# Altium project Nixie.PrjPcb
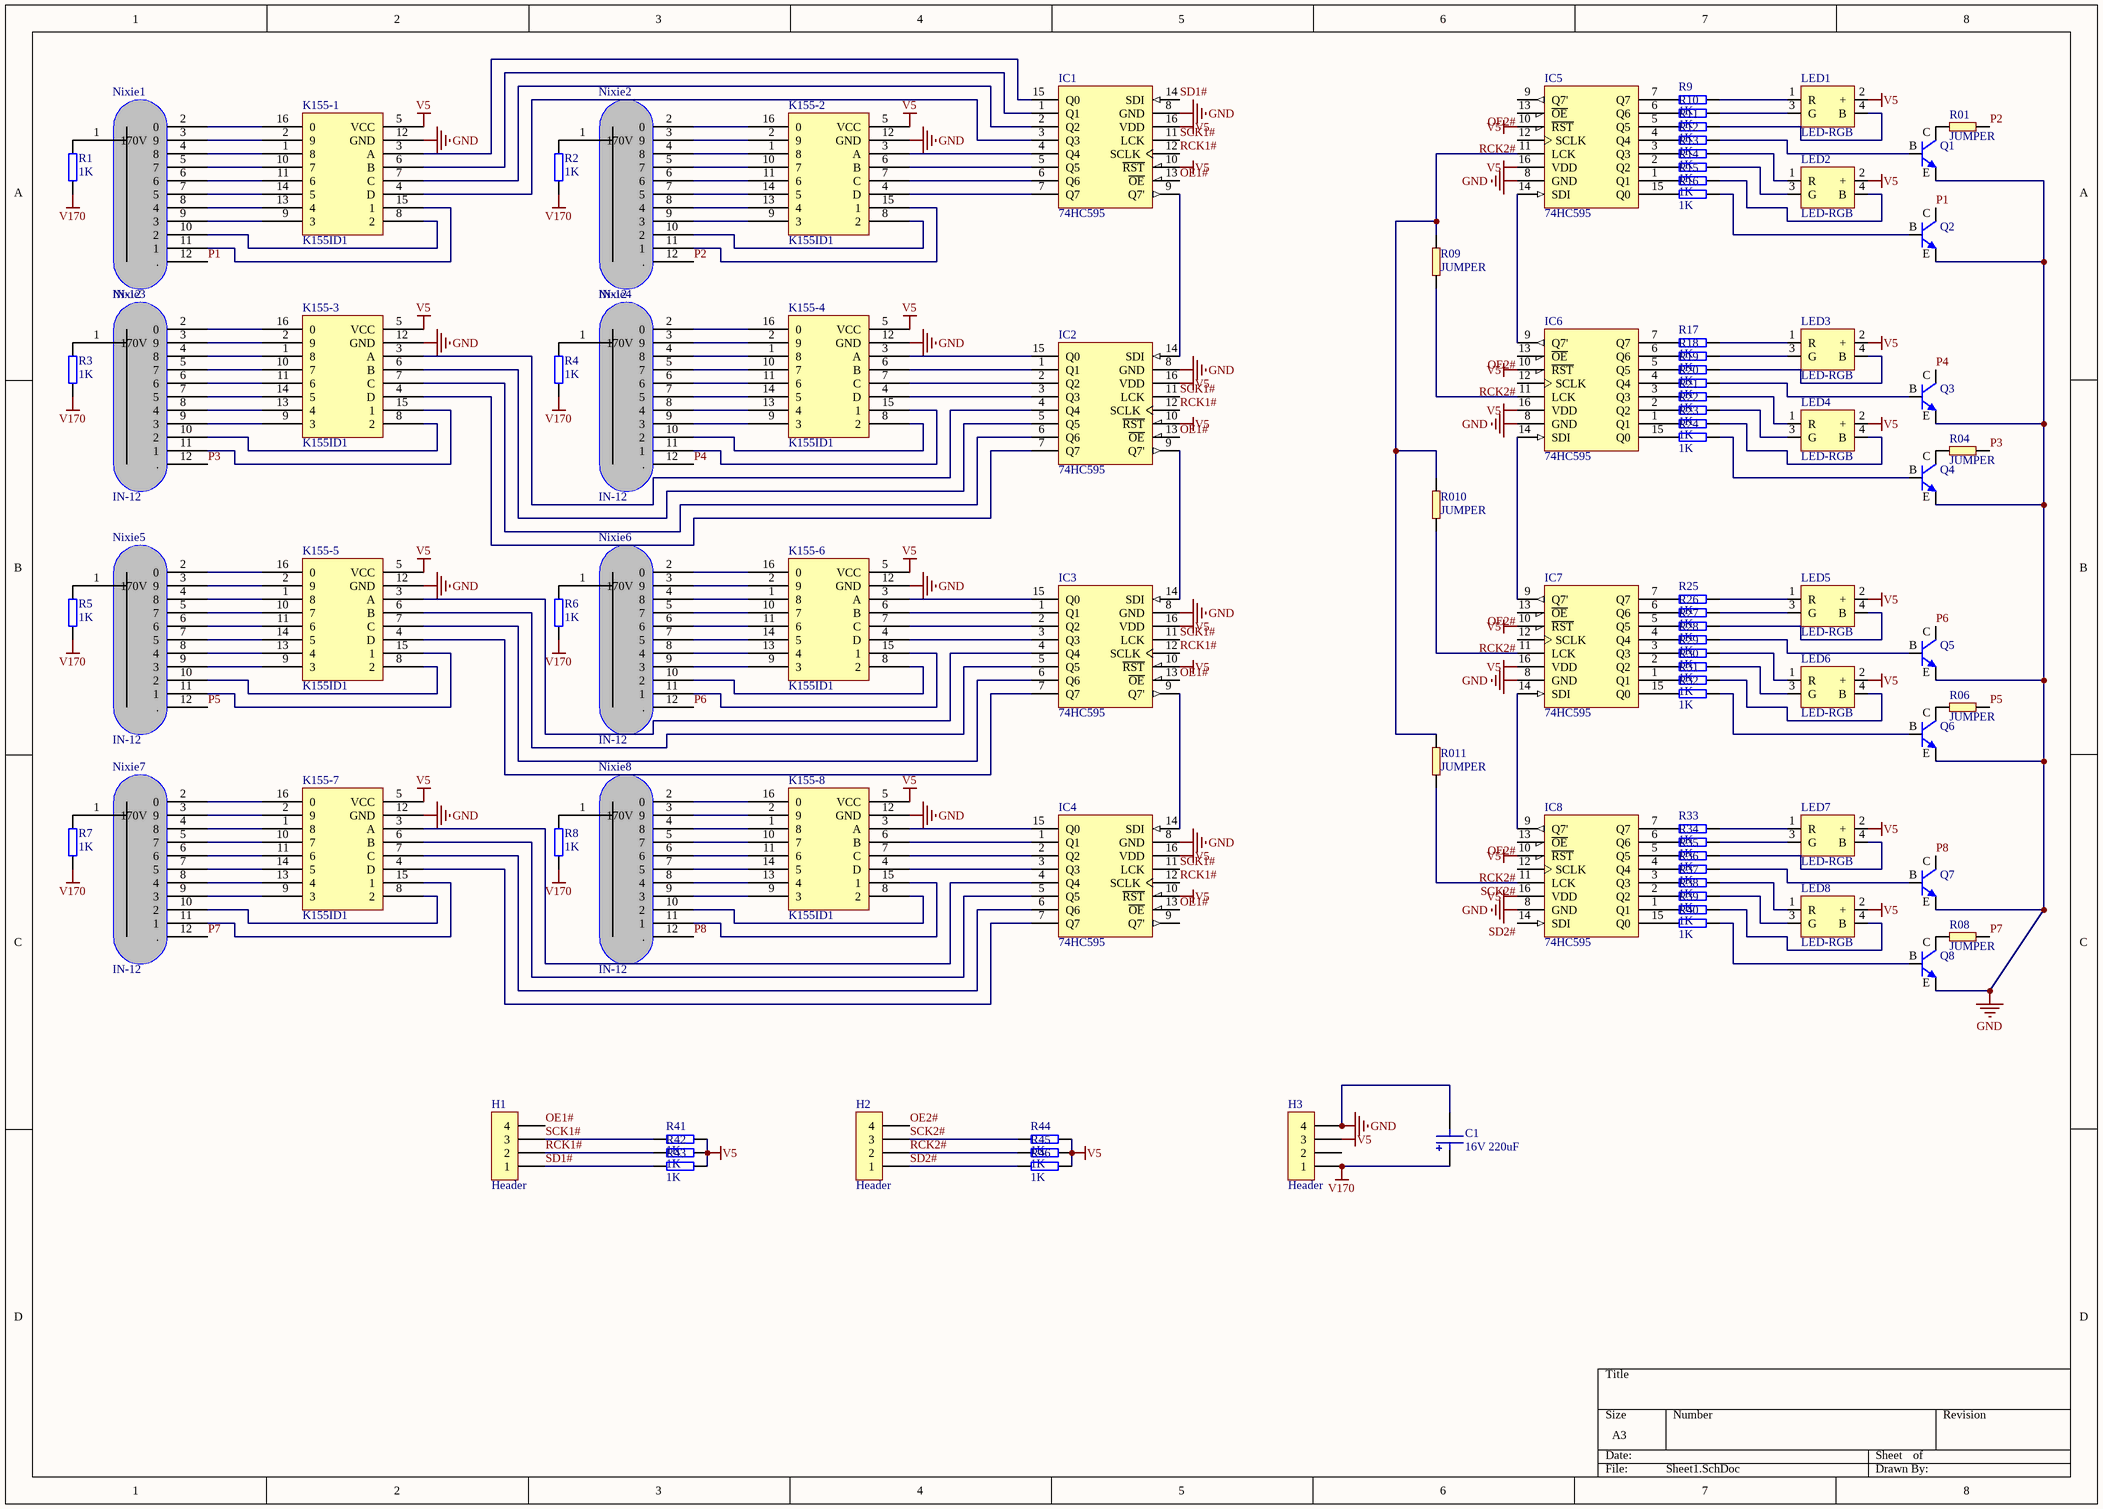
[diagram p0: Sheet1.SchDoc]
1 sheet, 97 parts. Net scope: global (net labels, ports and power ports of the same name join across sheets).
Board file: PCB1.PcbDoc

## Sheet Sheet1.SchDoc
size A3

### Parts
C1  16V 220uF  [ED4]
H1  Header  [HDR1X4]
H2  Header  [HDR1X4]
H3  Header  [HDR1X4]
IC1  74HC595  [DIP16]
IC2  74HC595  [DIP16]
IC3  74HC595  [DIP16]
IC4  74HC595  [DIP16]
IC5  74HC595  [DIP16]
IC6  74HC595  [DIP16]
IC7  74HC595  [DIP16]
IC8  74HC595  [DIP16]
K155-1  K155ID1  [DIP16]
K155-2  K155ID1  [DIP16]
K155-3  K155ID1  [DIP16]
K155-4  K155ID1  [DIP16]
K155-5  K155ID1  [DIP16]
K155-6  K155ID1  [DIP16]
K155-7  K155ID1  [DIP16]
K155-8  K155ID1  [DIP16]
LED1  LED-RGB  [LED3528-4]
LED2  LED-RGB  [LED3528-4]
LED3  LED-RGB  [LED3528-4]
LED4  LED-RGB  [LED3528-4]
LED5  LED-RGB  [LED3528-4]
LED6  LED-RGB  [LED3528-4]
LED7  LED-RGB  [LED3528-4]
LED8  LED-RGB  [LED3528-4]
Nixie1  IN-12  [IN-12]
Nixie2  IN-12  [IN-12]
Nixie3  IN-12  [IN-12]
Nixie4  IN-12  [IN-12]
Nixie5  IN-12  [IN-12]
Nixie6  IN-12  [IN-12]
Nixie7  IN-12  [IN-12]
Nixie8  IN-12  [IN-12]
Q1  NPN  [TO92A]  (value not drawn)
Q2  NPN  [TO92A]  (value not drawn)
Q3  NPN  [TO92A]  (value not drawn)
Q4  NPN  [TO92A]  (value not drawn)
Q5  NPN  [TO92A]  (value not drawn)
Q6  NPN  [TO92A]  (value not drawn)
Q7  NPN  [TO92A]  (value not drawn)
Q8  NPN  [TO92A]  (value not drawn)
R1  1K  [R0805]
R01  JUMPER  [R0]
R2  1K  [R0805]
R3  1K  [R0805]
R4  1K  [R0805]
R04  JUMPER  [R0]
R5  1K  [R0805]
R6  1K  [R0805]
R06  JUMPER  [R0]
R7  1K  [R0805]
R8  1K  [R0805]
R08  JUMPER  [R0]
R9  1K  [R0805]
R09  JUMPER  [R0]
R10  1K  [R0805]
R010  JUMPER  [R0]
R11  1K  [R0805]
R011  JUMPER  [R0]
R12  1K  [R0805]
R13  1K  [R0805]
R14  1K  [R0805]
R15  1K  [R0805]
R16  1K  [R0805]
R17  1K  [R0805]
R18  1K  [R0805]
R19  1K  [R0805]
R20  1K  [R0805]
R21  1K  [R0805]
R22  1K  [R0805]
R23  1K  [R0805]
R24  1K  [R0805]
R25  1K  [R0805]
R26  1K  [R0805]
R27  1K  [R0805]
R28  1K  [R0805]
R29  1K  [R0805]
R30  1K  [R0805]
R31  1K  [R0805]
R32  1K  [R0805]
R33  1K  [R0805]
R34  1K  [R0805]
R35  1K  [R0805]
R36  1K  [R0805]
R37  1K  [R0805]
R38  1K  [R0805]
R39  1K  [R0805]
R40  1K  [R0805]
R41  1K  [R0805]
R42  1K  [R0805]
R43  1K  [R0805]
R44  1K  [R0805]
R45  1K  [R0805]
R46  1K  [R0805]

### Nets
GND: C1.2(-) H3.4 IC1.8(GND) IC2.8(GND) IC3.8(GND) IC4.8(GND) IC5.8(GND) IC6.8(GND) IC7.8(GND) IC8.8(GND) K155-1.12(GND) K155-2.12(GND) K155-3.12(GND) K155-4.12(GND) K155-5.12(GND) K155-6.12(GND) K155-7.12(GND) K155-8.12(GND) Q1.1(E) Q2.1(E) Q3.1(E) Q4.1(E) Q5.1(E) Q6.1(E) Q7.1(E) Q8.1(E)
V5: H3.3 IC1.10(~{RST}) IC1.16(VDD) IC2.10(~{RST}) IC2.16(VDD) IC3.10(~{RST}) IC3.16(VDD) IC4.10(~{RST}) IC4.16(VDD) IC5.10(~{RST}) IC5.16(VDD) IC6.10(~{RST}) IC6.16(VDD) IC7.10(~{RST}) IC7.16(VDD) IC8.10(~{RST}) IC8.16(VDD) K155-1.5(VCC) K155-2.5(VCC) K155-3.5(VCC) K155-4.5(VCC) K155-5.5(VCC) K155-6.5(VCC) K155-7.5(VCC) K155-8.5(VCC) LED1.2(+) LED2.2(+) LED3.2(+) LED4.2(+) LED5.2(+) LED6.2(+) LED7.2(+) LED8.2(+) R41.2 R42.2 R43.2 R44.2 R45.2 R46.2
V170: C1.1(+) H3.1 R1.1 R2.1 R3.1 R4.1 R5.1 R6.1 R7.1 R8.1
OE1#: H1.4 IC1.13(~{OE}) IC2.13(~{OE}) IC3.13(~{OE}) IC4.13(~{OE})
OE2#: H2.4 IC5.13(~{OE}) IC6.13(~{OE}) IC7.13(~{OE}) IC8.13(~{OE})
P1: Nixie1.12(.) Q2.3(C)
P2: Nixie2.12(.) R01.2
P3: Nixie3.12(.) R04.2
P4: Nixie4.12(.) Q3.3(C)
P5: Nixie5.12(.) R06.2
P6: Nixie6.12(.) Q5.3(C)
P7: Nixie7.12(.) R08.2
P8: Nixie8.12(.) Q7.3(C)
RCK1#: H1.2 IC1.12(SCLK) IC2.12(SCLK) IC3.12(SCLK) IC4.12(SCLK) R42.1
RCK2#: H2.2 IC5.12(SCLK) IC6.12(SCLK) IC7.12(SCLK) IC8.12(SCLK) R45.1
SCK1#: H1.3 IC1.11(LCK) IC2.11(LCK) IC3.11(LCK) IC4.11(LCK) R41.1
SCK2#: H2.3 IC8.11(LCK) R011.1 R44.1
SD1#: H1.1 IC1.14(SDI) R43.1
SD2#: H2.1 IC8.14(SDI) R46.1
NetIC1_1: IC1.1(Q1) K155-1.6(B)
NetIC1_2: IC1.2(Q2) K155-1.7(C)
NetIC1_3: IC1.3(Q3) K155-1.4(D)
NetIC1_4: IC1.4(Q4) K155-2.3(A)
NetIC1_5: IC1.5(Q5) K155-2.6(B)
NetIC1_6: IC1.6(Q6) K155-2.7(C)
NetIC1_7: IC1.7(Q7) K155-2.4(D)
NetIC1_9: IC1.9(Q7') IC2.14(SDI)
NetIC1_15: IC1.15(Q0) K155-1.3(A)
NetIC2_1: IC2.1(Q1) K155-4.6(B)
NetIC2_2: IC2.2(Q2) K155-4.7(C)
NetIC2_3: IC2.3(Q3) K155-4.4(D)
NetIC2_4: IC2.4(Q4) K155-3.3(A)
NetIC2_5: IC2.5(Q5) K155-3.6(B)
NetIC2_6: IC2.6(Q6) K155-3.7(C)
NetIC2_7: IC2.7(Q7) K155-3.4(D)
NetIC2_9: IC2.9(Q7') IC3.14(SDI)
NetIC2_15: IC2.15(Q0) K155-4.3(A)
NetIC3_1: IC3.1(Q1) K155-6.6(B)
NetIC3_2: IC3.2(Q2) K155-6.7(C)
NetIC3_3: IC3.3(Q3) K155-6.4(D)
NetIC3_4: IC3.4(Q4) K155-5.3(A)
NetIC3_5: IC3.5(Q5) K155-5.6(B)
NetIC3_6: IC3.6(Q6) K155-5.7(C)
NetIC3_7: IC3.7(Q7) K155-5.4(D)
NetIC3_9: IC3.9(Q7') IC4.14(SDI)
NetIC3_15: IC3.15(Q0) K155-6.3(A)
NetIC4_1: IC4.1(Q1) K155-8.6(B)
NetIC4_2: IC4.2(Q2) K155-8.7(C)
NetIC4_3: IC4.3(Q3) K155-8.4(D)
NetIC4_4: IC4.4(Q4) K155-7.3(A)
NetIC4_5: IC4.5(Q5) K155-7.6(B)
NetIC4_6: IC4.6(Q6) K155-7.7(C)
NetIC4_7: IC4.7(Q7) K155-7.4(D)
NetIC4_15: IC4.15(Q0) K155-8.3(A)
NetIC5_1: IC5.1(Q1) R15.1
NetIC5_2: IC5.2(Q2) R14.1
NetIC5_3: IC5.3(Q3) R13.1
NetIC5_4: IC5.4(Q4) R12.1
NetIC5_5: IC5.5(Q5) R11.1
NetIC5_6: IC5.6(Q6) R10.1
NetIC5_7: IC5.7(Q7) R9.1
NetIC5_11: IC5.11(LCK) R09.2 R010.2 R011.2
NetIC5_14: IC5.14(SDI) IC6.9(Q7')
NetIC5_15: IC5.15(Q0) R16.1
NetIC6_1: IC6.1(Q1) R23.1
NetIC6_2: IC6.2(Q2) R22.1
NetIC6_3: IC6.3(Q3) R21.1
NetIC6_4: IC6.4(Q4) R20.1
NetIC6_5: IC6.5(Q5) R19.1
NetIC6_6: IC6.6(Q6) R18.1
NetIC6_7: IC6.7(Q7) R17.1
NetIC6_11: IC6.11(LCK) R09.1
NetIC6_14: IC6.14(SDI) IC7.9(Q7')
NetIC6_15: IC6.15(Q0) R24.1
NetIC7_1: IC7.1(Q1) R31.1
NetIC7_2: IC7.2(Q2) R30.1
NetIC7_3: IC7.3(Q3) R29.1
NetIC7_4: IC7.4(Q4) R28.1
NetIC7_5: IC7.5(Q5) R27.1
NetIC7_6: IC7.6(Q6) R26.1
NetIC7_7: IC7.7(Q7) R25.1
NetIC7_11: IC7.11(LCK) R010.1
NetIC7_14: IC7.14(SDI) IC8.9(Q7')
NetIC7_15: IC7.15(Q0) R32.1
NetIC8_1: IC8.1(Q1) R39.1
NetIC8_2: IC8.2(Q2) R38.1
NetIC8_3: IC8.3(Q3) R37.1
NetIC8_4: IC8.4(Q4) R36.1
NetIC8_5: IC8.5(Q5) R35.1
NetIC8_6: IC8.6(Q6) R34.1
NetIC8_7: IC8.7(Q7) R33.1
NetIC8_15: IC8.15(Q0) R40.1
NetK155-1_1: K155-1.1(8) Nixie1.4(8)
NetK155-1_2: K155-1.2(9) Nixie1.3(9)
NetK155-1_8: K155-1.8(2) Nixie1.10(2)
NetK155-1_9: K155-1.9(3) Nixie1.9(3)
NetK155-1_10: K155-1.10(7) Nixie1.5(7)
NetK155-1_11: K155-1.11(6) Nixie1.6
NetK155-1_13: K155-1.13(4) Nixie1.8(4)
NetK155-1_14: K155-1.14(5) Nixie1.7(5)
NetK155-1_15: K155-1.15(1) Nixie1.11(1)
NetK155-1_16: K155-1.16(0) Nixie1.2(0)
NetK155-2_1: K155-2.1(8) Nixie2.4(8)
NetK155-2_2: K155-2.2(9) Nixie2.3(9)
NetK155-2_8: K155-2.8(2) Nixie2.10(2)
NetK155-2_9: K155-2.9(3) Nixie2.9(3)
NetK155-2_10: K155-2.10(7) Nixie2.5(7)
NetK155-2_11: K155-2.11(6) Nixie2.6
NetK155-2_13: K155-2.13(4) Nixie2.8(4)
NetK155-2_14: K155-2.14(5) Nixie2.7(5)
NetK155-2_15: K155-2.15(1) Nixie2.11(1)
NetK155-2_16: K155-2.16(0) Nixie2.2(0)
NetK155-3_1: K155-3.1(8) Nixie3.4(8)
NetK155-3_2: K155-3.2(9) Nixie3.3(9)
NetK155-3_8: K155-3.8(2) Nixie3.10(2)
NetK155-3_9: K155-3.9(3) Nixie3.9(3)
NetK155-3_10: K155-3.10(7) Nixie3.5(7)
NetK155-3_11: K155-3.11(6) Nixie3.6
NetK155-3_13: K155-3.13(4) Nixie3.8(4)
NetK155-3_14: K155-3.14(5) Nixie3.7(5)
NetK155-3_15: K155-3.15(1) Nixie3.11(1)
NetK155-3_16: K155-3.16(0) Nixie3.2(0)
NetK155-4_1: K155-4.1(8) Nixie4.4(8)
NetK155-4_2: K155-4.2(9) Nixie4.3(9)
NetK155-4_8: K155-4.8(2) Nixie4.10(2)
NetK155-4_9: K155-4.9(3) Nixie4.9(3)
NetK155-4_10: K155-4.10(7) Nixie4.5(7)
NetK155-4_11: K155-4.11(6) Nixie4.6
NetK155-4_13: K155-4.13(4) Nixie4.8(4)
NetK155-4_14: K155-4.14(5) Nixie4.7(5)
NetK155-4_15: K155-4.15(1) Nixie4.11(1)
NetK155-4_16: K155-4.16(0) Nixie4.2(0)
NetK155-5_1: K155-5.1(8) Nixie5.4(8)
NetK155-5_2: K155-5.2(9) Nixie5.3(9)
NetK155-5_8: K155-5.8(2) Nixie5.10(2)
NetK155-5_9: K155-5.9(3) Nixie5.9(3)
NetK155-5_10: K155-5.10(7) Nixie5.5(7)
NetK155-5_11: K155-5.11(6) Nixie5.6
NetK155-5_13: K155-5.13(4) Nixie5.8(4)
NetK155-5_14: K155-5.14(5) Nixie5.7(5)
NetK155-5_15: K155-5.15(1) Nixie5.11(1)
NetK155-5_16: K155-5.16(0) Nixie5.2(0)
NetK155-6_1: K155-6.1(8) Nixie6.4(8)
NetK155-6_2: K155-6.2(9) Nixie6.3(9)
NetK155-6_8: K155-6.8(2) Nixie6.10(2)
NetK155-6_9: K155-6.9(3) Nixie6.9(3)
NetK155-6_10: K155-6.10(7) Nixie6.5(7)
NetK155-6_11: K155-6.11(6) Nixie6.6
NetK155-6_13: K155-6.13(4) Nixie6.8(4)
NetK155-6_14: K155-6.14(5) Nixie6.7(5)
NetK155-6_15: K155-6.15(1) Nixie6.11(1)
NetK155-6_16: K155-6.16(0) Nixie6.2(0)
NetK155-7_1: K155-7.1(8) Nixie7.4(8)
NetK155-7_2: K155-7.2(9) Nixie7.3(9)
NetK155-7_8: K155-7.8(2) Nixie7.10(2)
NetK155-7_9: K155-7.9(3) Nixie7.9(3)
NetK155-7_10: K155-7.10(7) Nixie7.5(7)
NetK155-7_11: K155-7.11(6) Nixie7.6
NetK155-7_13: K155-7.13(4) Nixie7.8(4)
NetK155-7_14: K155-7.14(5) Nixie7.7(5)
NetK155-7_15: K155-7.15(1) Nixie7.11(1)
NetK155-7_16: K155-7.16(0) Nixie7.2(0)
NetK155-8_1: K155-8.1(8) Nixie8.4(8)
NetK155-8_2: K155-8.2(9) Nixie8.3(9)
NetK155-8_8: K155-8.8(2) Nixie8.10(2)
NetK155-8_9: K155-8.9(3) Nixie8.9(3)
NetK155-8_10: K155-8.10(7) Nixie8.5(7)
NetK155-8_11: K155-8.11(6) Nixie8.6
NetK155-8_13: K155-8.13(4) Nixie8.8(4)
NetK155-8_14: K155-8.14(5) Nixie8.7(5)
NetK155-8_15: K155-8.15(1) Nixie8.11(1)
NetK155-8_16: K155-8.16(0) Nixie8.2(0)
NetLED1_1: LED1.1(R) R9.2
NetLED1_3: LED1.3(G) R10.2
NetLED1_4: LED1.4(B) R11.2
NetLED2_1: LED2.1(R) R13.2
NetLED2_3: LED2.3(G) R14.2
NetLED2_4: LED2.4(B) R15.2
NetLED3_1: LED3.1(R) R17.2
NetLED3_3: LED3.3(G) R18.2
NetLED3_4: LED3.4(B) R19.2
NetLED4_1: LED4.1(R) R21.2
NetLED4_3: LED4.3(G) R22.2
NetLED4_4: LED4.4(B) R23.2
NetLED5_1: LED5.1(R) R25.2
NetLED5_3: LED5.3(G) R26.2
NetLED5_4: LED5.4(B) R27.2
NetLED6_1: LED6.1(R) R29.2
NetLED6_3: LED6.3(G) R30.2
NetLED6_4: LED6.4(B) R31.2
NetLED7_1: LED7.1(R) R33.2
NetLED7_3: LED7.3(G) R34.2
NetLED7_4: LED7.4(B) R35.2
NetLED8_1: LED8.1(R) R37.2
NetLED8_3: LED8.3(G) R38.2
NetLED8_4: LED8.4(B) R39.2
NetNixie1_1: Nixie1.1(170V) R1.2
NetNixie2_1: Nixie2.1(170V) R2.2
NetNixie3_1: Nixie3.1(170V) R3.2
NetNixie4_1: Nixie4.1(170V) R4.2
NetNixie5_1: Nixie5.1(170V) R5.2
NetNixie6_1: Nixie6.1(170V) R6.2
NetNixie7_1: Nixie7.1(170V) R7.2
NetNixie8_1: Nixie8.1(170V) R8.2
NetQ1_2: Q1.2(B) R12.2
NetQ1_3: Q1.3(C) R01.1
NetQ2_2: Q2.2(B) R16.2
NetQ3_2: Q3.2(B) R20.2
NetQ4_2: Q4.2(B) R24.2
NetQ4_3: Q4.3(C) R04.1
NetQ5_2: Q5.2(B) R28.2
NetQ6_2: Q6.2(B) R32.2
NetQ6_3: Q6.3(C) R06.1
NetQ7_2: Q7.2(B) R36.2
NetQ8_2: Q8.2(B) R40.2
NetQ8_3: Q8.3(C) R08.1

Not connected (* = marked no-connect by the designer): H3 2; IC4 9(Q7'); IC5 9(Q7')

### Library data of the parts
C1 = CAP-POL-SMD: 贴片电容（有极性）
H1-H3 = Header-4
IC1-IC8 = 74HC595: 8-bit移位寄存器
LED1-LED8 = LED-RGB: 彩色LED
Q1-Q8 = NPN: NPN三极管
R1-R46 = RES: 电阻
R01 R04 R06 R08 R09 R010 R011 = R0: 跳线-贴片